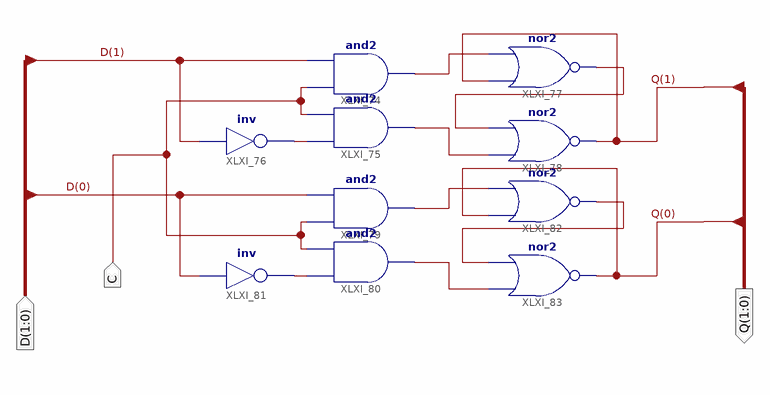
[diagram p0: schematic sheet 1]
// Xilinx ISE schematic twoRegisters.sch (spartan3e) as structural Verilog: 10 symbols, 3 ports
module twoRegisters (
  input  [1:0] D,
  input  C,
  output [1:0] Q
);

  wire XLXN_154, XLXN_156, XLXN_157, XLXN_163, XLXN_165, XLXN_166, XLXN_182, XLXN_183;

  and XLXI_74 (XLXN_156, C, D[1]);
  and XLXI_75 (XLXN_157, XLXN_154, C);
  not XLXI_76 (XLXN_154, D[1]);
  nor XLXI_77 (XLXN_183, Q[1], XLXN_156);
  nor XLXI_78 (Q[1], XLXN_157, XLXN_183);
  and XLXI_79 (XLXN_165, C, D[0]);
  and XLXI_80 (XLXN_166, XLXN_163, C);
  not XLXI_81 (XLXN_163, D[0]);
  nor XLXI_82 (XLXN_182, Q[0], XLXN_165);
  nor XLXI_83 (Q[0], XLXN_166, XLXN_182);
endmodule
